# Altium project RFID_Lock.PrjPcb
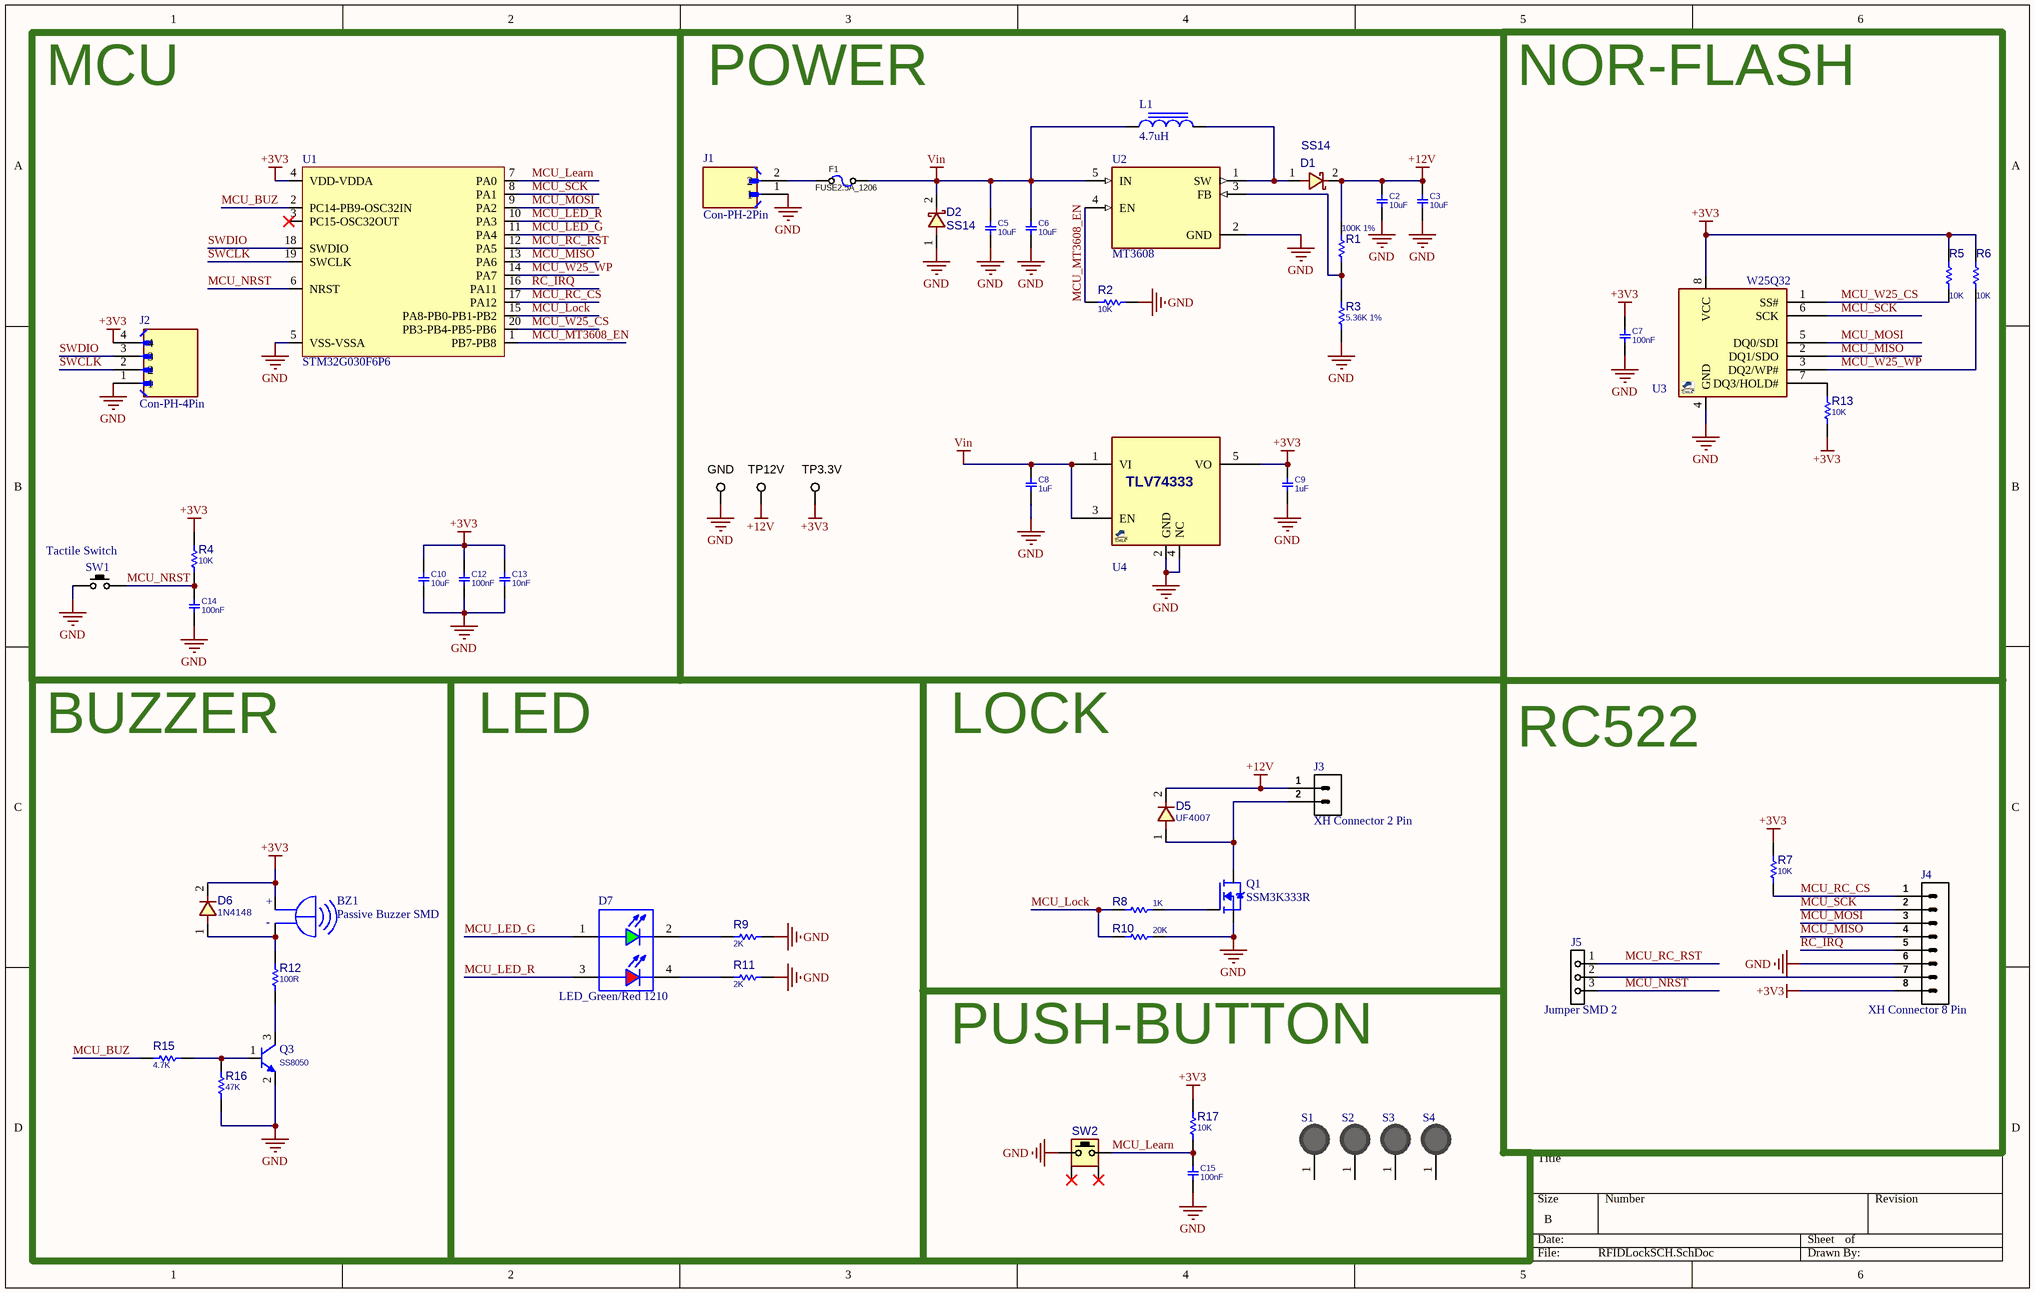
[diagram p0: RFIDLockSCH.SchDoc]
1 sheet, 56 parts. Net scope: global (net labels, ports and power ports of the same name join across sheets).
Board file: RFIDLockPCB.PcbDoc

## Sheet RFIDLockSCH.SchDoc
size B; SheetNumber: 1; SheetTotal: 1

### Parts
BZ1  Passive Buzzer SMD  [Passive Buzzer SMD]
C2  10uF  [C1206]
C3  10uF  [C1206]
C5  10uF  [C1206]
C6  10uF  [C1206]
C7  100nF  [C0805]
C8  1uF  [C0805]
C9  1uF  [C0805]
C10  10uF  [C0805]
C12  100nF  [C0805]
C13  10nF  [C0805]
C14  100nF  [C0805]
C15  100nF  [C0805]
D1  SS14  [D_SMA]
D2  SS14  [D_SMA]
D5  UF4007  [D_SMA]
D6  1N4148  [D_SOD123W]
D7  LED_Green/Red 1210  [LED_Green/Red 1210]
F1  FUSE2.5A_1206  [F1206]
GND  TESTPOINT_SMD  [TPSMD_S1]  (value not drawn)  (no BOM)
J1  Con-PH-2Pin  [Con-PH-2Pin-RA]
J2  Con-PH-4Pin  [Con-PH-4Pin-ST]
J3  XH Connector 2 Pin  [XH 2 Pin - 2.5mm]
J4  XH Connector 8 Pin  [XH 8 Pin - 2.5mm]
J5  Jumper SMD 2  [Jumper SMD 2]
L1  4.7uH  [SMD Inductor 3]
Q1  SSM3K333R  [SSM3K333R]
Q3  SS8050  [SOT23_3]
R1  100K 1%  [R0805]
R2  10K  [R0805]
R3  5.36K 1%  [R0805]
R4  10K  [R0805]
R5  10K  [R0805]
R6  10K  [R0805]
R7  10K  [R0805]
R8  1K  [R0805]
R9  2K  [R0805]
R10  20K  [R0805]
R11  2K  [R0805]
R12  100R  [R0805]
R13  10K  [R0805]
R15  4.7K  [R0805]
R16  47K  [R0805]
R17  10K  [R0805]
S1  Screw 1  [Screw 1]  (value not drawn)
S2  Screw 1  [Screw 1]  (value not drawn)
S3  Screw 1  [Screw 1]  (value not drawn)
S4  Screw 1  [Screw 1]  (value not drawn)
SW1  Tactile Switch  [Tactil Switch 3*4*2]
SW2  PUSHBUTTON  [SWPBT_SPST_R_6X6X10]  (value not drawn)
TP3.3V  TESTPOINT_SMD  [TPSMD_S1]  (value not drawn)  (no BOM)
TP12V  TESTPOINT_SMD  [TPSMD_S1]  (value not drawn)  (no BOM)
U1  STM32G030F6P6  [STM32G030F6P6]
U2  MT3608  [MT3608]
U3  W25Q32  [SO_8_W]
U4  TLV74333  [SOT23_5]  (value not drawn)

### Blocks framed on the sheet
MCU: C10 C12-C14 J2 R4 SW1 U1

### Nets
+3V3: BZ1.P(POS) C7.2 C9.2 C10.2 C12.2 C13.2 D6.2 J2.4 J4.8 R4.1 R5.1 R6.1 R7.1 R13.1 R17.1 TP3.3V.1 U1.4(VDD-VDDA) U3.8(VCC) U4.5(VO)
+12V: C2.2 C3.2 D1.2 D5.2 J3.1 R1.2 TP12V.1
GND: C2.1 C3.1 C5.1 C6.1 C7.1 C8.1 C9.1 C10.1 C12.1 C13.1 C14.1 C15.1 D2.1 GND.1 J1.1 J2.1 J4.6 Q1.2(S) Q3.2(E) R2.1 R3.1 R9.2 R10.1 R11.2 R16.2 SW1.1(P1) SW2.1 U1.5(VSS-VSSA) U2.2(GND) U3.4(GND) U4.2(GND) U4.4(NC)
Vin: C5.2 C6.2 C8.2 D2.2 F1.2 L1.1 U2.5(IN) U4.1(VI) U4.3(EN)
MCU_BUZ: R15.2 U1.2(PC14-PB9-OSC32IN)
MCU_Learn: C15.2 R17.2 SW2.2 U1.7(PA0)
MCU_LED_G: D7.1(A) U1.11(PA4)
MCU_LED_R: D7.3(GREEN_K) U1.10(PA3)
MCU_Lock: R8.1 R10.2 U1.15(PA8-PB0-PB1-PB2)
MCU_MISO: J4.4 U1.13(PA6) U3.2(DQ1/SDO)
MCU_MOSI: J4.3 U1.9(PA2) U3.5(DQ0/SDI)
MCU_MT3608_EN: R2.2 U1.1(PB7-PB8) U2.4(EN)
MCU_NRST: C14.2 J5.3 R4.2 SW1.2(P3) U1.6(NRST)
MCU_RC_CS: J4.1 R7.2 U1.17(PA12)
MCU_RC_RST: J5.1 U1.12(PA5)
MCU_SCK: J4.2 U1.8(PA1) U3.6(SCK)
MCU_W25_CS: R5.2 U1.20(PB3-PB4-PB5-PB6) U3.1(SS#)
MCU_W25_WP: R6.2 U1.14(PA7) U3.3(DQ2/WP#)
RC_IRQ: J4.5 U1.16(PA11)
SWCLK: J2.2 U1.19(SWCLK)
SWDIO: J2.3 U1.18(SWDIO)
NetBZ1_N: BZ1.N(NEG) D6.1 R12.1
NetD1_1: D1.1 L1.2 U2.1(SW)
NetD5_1: D5.1 J3.2 Q1.3(D)
NetD7_2: D7.2(RED_K) R9.1
NetD7_4: D7.4(BLUE_K) R11.1
NetF1_1: F1.1 J1.2
NetJ4_7: J4.7 J5.2
NetQ1_1: Q1.1(G) R8.2
NetQ3_1: Q3.1(B) R15.1 R16.1
NetQ3_3: Q3.3(C) R12.2
NetR1_1: R1.1 R3.2 U2.3(FB)
NetR13_2: R13.2 U3.7(DQ3/HOLD#)

Not connected (* = marked no-connect by the designer): S1 1; S2 1; S3 1; S4 1; SW2 MH1* MH2*; U1 3(PC15-OSC32OUT)*

### Notes on the sheet
- POWER
- NOR-FLASH
- BUZZER
- LED
- LOCK
- RC522
- PUSH-BUTTON
- (in symbol Passive Buzzer SMD) +; -

### Library data of the parts
BZ1 = Passive Buzzer SMD: Passive Buzzer 3.6V 8.5*8.5mm
C2 C3 C5 C6 = CAP_SMD_MLCC_1206: CAP, MLCC, -F, -V, MATERIAL, -%, 0201; PARAM: -, -%; MANF_P#: MANF_PART#; PRICE: 100= 1$; MANF: -; PARAM2: -V; ASSEMBLY: ASSEMBLY; VALUE: 10uF
C7-C10 C12-C15 = CAP_SMD_MLCC_0805: CAP, MLCC, -F, -V, MATERIAL, -%, 0201; PARAM: -, -%; MANF_P#: MANF_PART#; PRICE: 100= 1$; MANF: -; PARAM2: -V; ASSEMBLY: ASSEMBLY
  C7 C12 C14 C15: VALUE: 100nF
  C8 C9: VALUE: 1uF
  C10: VALUE: 10uF
  C13: VALUE: 10nF
D1 D2 = DIODE_SMD_SCHOTTKY_1N5822: DIODE, SCHOTTKY, 40V, 3A; MANF: DIODES; MANF_P#: 1N5822; DESC: DESCRIPTION; ASSEMBLY: ASSEMBLY; PRICE: PRICE; PARAM2: 3A; PARAM: 40V; VALUE: SS14
D5 = DIODE_SMD_1N4001: DIODE, GENERAL PURPOSE, 50V/1A; DESC: DESCRIPTION; PARAM: 50V VRRM; PARAM2: 1A; MANF_P#: 1N4001; MANF: MANF; ASSEMBLY: ASSEMBLY; PRICE: PRICE; VALUE: UF4007
D6 = DIODE_SMD_1N4148_SOD123: DIODE, FAST SWTICHING, SMD; DESC: DESCRIPTION; PARAM: 300mA; PARAM2: 100V, 460MW; MANF_P#: 1N4148W; MANF: DIODE; ASSEMBLY: ASSEMBLY; PRICE: PRICE; VALUE: 1N4148
D7 = LED_Green/Red 1210: Red, Green, Blue (RGB) 626nm Red, 525nm Green, 470nm Blue LED Indication - Discrete 1.9V Red, 3.5V Green, 3.5V Blue 1210 (3225 Metric)
F1 = FUSE_3A_1206_SLOW: Fuse, 3A, 32VDC, 1206, SMD, Slow Blow; PARAM: 2A; 32VDC; Slow Blow; MANF: Bourns; MANF_P#: SF-1206SP300-2; PARAM2: 0.027Ohm; PRICE: 0.9$; VALUE: FUSE2.5A_1206
GND TP3.3V TP12V = TESTPOINT_SMD: TEST POINT; MANF: MANF; MANF_P#: MANF_P#; VALUE: VALUE
J1 = Con-PH-2Pin: Connector Header Through Hole 2 position 0.079 (2.00mm)
J2 = Con-PH-4Pin: Connector Header Through Hole 4 position 0.079 (2.00mm)
J3 = XH 2: XH, 2-Pin; Current: 3A; Library Link: https://github.com/Majid-Derhambakhsh; Publisher: Majid Derhambakhsh
J4 = XH 8: XH, 8-Pin; Current: 3A; Library Link: https://github.com/Majid-Derhambakhsh; Publisher: Majid Derhambakhsh
J5 = Jumper SMD 2: 3Pin Jumper
L1 = SMD Inductor 3: 1008 (2520 metric) Part Number : DFE252012F-4R7M=P2
Q1 = SSM3K333R: N-Channel 30 V 6A (Ta) 1W (Ta) Surface Mount SOT-23F
Q3 = NPN_SS8050_SOT23: BJT, NPN, 25v, 1.5A, SMD, SOT23; PARAM2: 300mW; MANF: GALAXY; PARAM: 25v, 1.5A; MANF_P#: SS8050; VALUE: SS8050
R1 R3 = RES_SMD_0805: RESISTOR, SMD; PARAM: -W; DESC: DESCRIPTION; DIST#: MOUSER; MANF_P#: -; MANF: -; ASSEMBLY: ASSEMBLY; PRICE: 100= 0.5$; PARAM2: 1%
  R1: VALUE: 100K 1%
  R3: VALUE: 5.36K 1%
R2 R4-R13 R15-R17 = RES_SMD_0805: RESISTOR, SMD; PARAM: -W; DESC: DESCRIPTION; DIST#: MOUSER; PARAM2: 1%; MANF_P#: -; MANF: -; ASSEMBLY: ASSEMBLY; PRICE: 100= 0.5$
  R2 R4-R7 R13 R17: VALUE: 10K
  R8: VALUE: 1K
  R9 R11: VALUE: 2K
  R10: VALUE: 20K
  R12: VALUE: 100R
  R15: VALUE: 4.7K
  R16: VALUE: 47K
S1-S4 = Screw 1: Screw 3
SW1 = Tactile Switch: 3x6x5 mm - 2 Pin
SW2 = SWPBT_SPST_R_6X6X10: SWITCH, PUSH BUTTON, TACTILE, THD, SPST, RIGHT; PARAM: 50mA/12VDC; DESC: DESCRIPTION; MANF: -; VALUE: PUSHBUTTON; ASSEMBLY: ASSEMBLY; PRICE: 0.3$; MANF_P#: -
U1 = STM32G030F6P6: STM32G030F6P6 . TSSOP-20 . 32KB flash . 8 KB SRAM . 17I/O . 64Mhz
U2 = MT3608: High Efficiency 1.2MHz2A Step Up Converter
U3 = W25Q64FV_SO8W: SPI FLASH Memory, 64Mb (8M x8), 104MHz; MANF: WINBOND; MANF_P#: W25Q64FVSSIG; PARAM2: 2.7~3.6V; PARAM: 64Mb (8M x8), 104MHz; PRICE: 1$; VALUE: W25Q32
U4 = VREG_TLV74333_SOT23: REG, Linear, LDO0.12V, Fixed, 300mA, VIN1.4~5.5V, VOUT1~5.5V, SOT-23-5; MANF: Texas Instruments; MANF_P#: TLV74333PDQN; PARAM2: 1.4~5.5Vin, LDO0.12V, Fixed3.0V; PARAM: 300mA, 50dB PSRR, -40~125°C; PRICE: $0.3; VALUE: TLV74333